# Altium schematic sheet I2C_OLED_DRV2605.SchDoc
size A; SheetNumber: 2; SheetTotal: 5
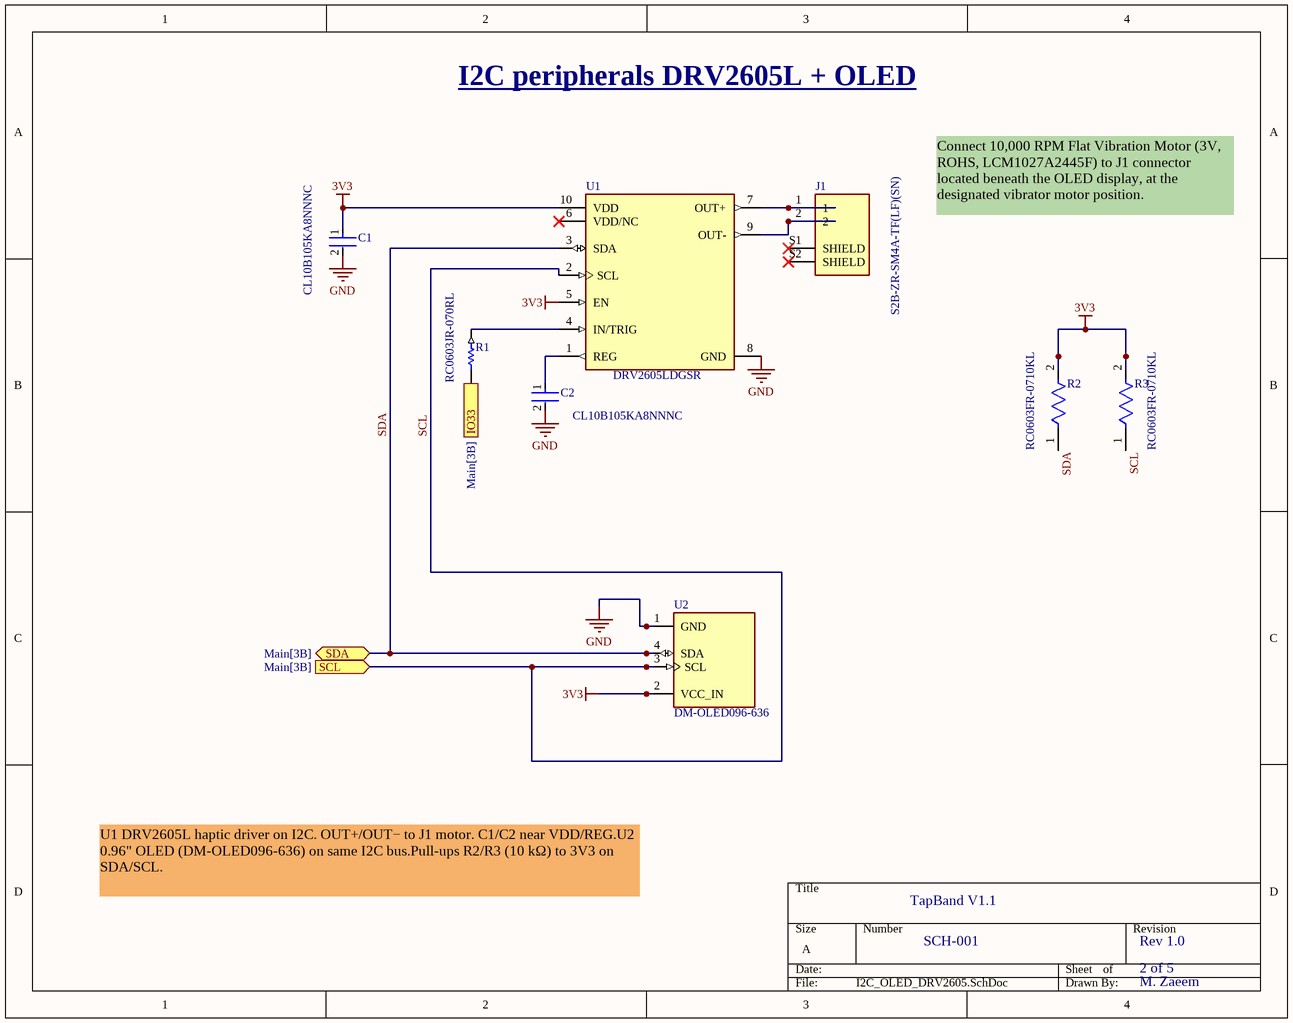
[diagram p0: I2C_OLED_DRV2605.SchDoc]

## Parts
C1  CL10B105KA8NNNC  [FP-CL10-IPC_C]
C2  CL10B105KA8NNNC  [FP-CL10-IPC_C]
J1  S2B-ZR-SM4A-TF(LF)(SN)  [JST_S2B-ZR-SM4A-TF(LF)(SN)]
R1  RC0603JR-070RL  [RESC1608X55X25ML10T15]
R2  RC0603FR-0710KL  [FP-RC0603-0_55-IPC_C]
R3  RC0603FR-0710KL  [FP-RC0603-0_55-IPC_C]
U1  DRV2605LDGSR  [FP-DGS0010A-MFG]
U2  DM-OLED096-636  [MODULE_DM-OLED096-636]

## Ports
IO33 (in, see Main[3B]), SCL (in, see Main[3B]), SDA (bidir, see Main[3B])

## Nets
3V3: C1.1 R2.2 R3.2 U1.5(EN) U1.10(VDD) U2.2(VCC_IN)
GND: C1.2 C2.2 U1.8(GND) U2.1(GND)
IO33: R1.2 ; port IO33
SCL: R3.1 U1.2(SCL) U2.3(SCL) ; port SCL
SDA: R2.1 U1.3(SDA) U2.4(SDA) ; port SDA
NetC2_1: C2.1 U1.1(REG)
NetJ1_1: J1.1 U1.7(OUT+)
NetJ1_2: J1.2 U1.9(OUT-)
NetR1_1: R1.1 U1.4(IN/TRIG)

Not connected (* = marked no-connect by the designer): J1 S1(SHIELD)* S2(SHIELD)*; U1 6(VDD/NC)*

## Notes on the sheet
- I2C peripherals DRV2605L + OLED
- Connect 10,000 RPM Flat Vibration Motor (3V, ROHS, LCM1027A2445F) to J1 connector located beneath the OLED display, at the designated vibrator motor position.
- U1 DRV2605L haptic driver on I2C. OUT+/OUT− to J1 motor. C1/C2 near VDD/REG.U2 0.96" OLED (DM‑OLED096‑636) on same I2C bus.Pull‑ups R2/R3 (10 kΩ) to 3V3 on SDA/SCL.
- TapBand V1.1
- SCH-001
- Rev 1.0
- 2 of 5
- M. Zaeem

## Library data of the parts
C1 C2 = CMP-13271-000007-2: CAP CER 1UF 25V X7R 0603; Tolerance: 10%; Width: 0.031inch; Packaging: Tape and Reel; Package Quantity: 1; Case/Package: 0603; Series: CL; Case Code (Imperial): 0603; Radiation Hardening: No; Thickness: 0.035inch; Case Code (Metric): 1608; Min Operating Temperature: -55°C; Depth: 0.8mm; RoHS Compliant: Yes; Height: 0.8mm; Capacitance: 1uF; Mount: Surface Mount; Construction: Flat; Length: 1.6mm; Max Operating Temperature: 125°C; Voltage: 25V; Dielectric: X7R; Contact Plating: Tin; Voltage Rating: 25V
J1 = S2B-ZR-SM4A-TF(LF)(SN): Connector Header Surface Mount, Right Angle 2 position 0.059 (1.50mm); MF: JST Sales; SnapEDA_Link: https://www.snapeda.com/parts/S2B-ZR-SM4A-TF%20(LF)(SN)/JST/view-part/?ref=snap; Package: None; Value: *; MP: S2B-ZR-SM4A-TF (LF)(SN); Check_prices: https://www.snapeda.com/parts/S2B-ZR-SM4A-TF%20(LF)(SN)/JST/view-part/?ref=eda
R1 = CMP-2100-03667-1: Chip Resistor, 0 Ohm, +/- 5%, 0.1 W, -55 to 155 degC, 0603 (1608 Metric), RoHS, Tape and Reel; Manufacturer: Yageo; Temperature Coefficient: 200ppm/degreesC; Voltage Rating: 50V; Power Rating: 100mW; Resistance: 0mOhm; Width: 0.8mm; Max Operating Temperature: 155degC; Tolerance: 5%; Package Reference: 0603; Height: 0.45mm; Depth: 0.8mm; Package Description: 2-Pin Surface Mount Device, Body 1.6 x 0.8 mm; Termination: SMD/SMT; Package Quantity: 5000; Case/Package: 0603; Case Code (Imperial): 0603; Radiation Hardening: No; Number of Pins: 2; Length: 1.6mm; Lead Free: LeadFree; Voltage Rating (DC): 50V; Military Standard: Not; Datasheet URL: http://www.yageo.com/NewPortal/yageodocoutput?fileName=/pdf/R-Chip/PYu-RC_Group_51_RoHS_L_5.pdf; Manufacturer URL: http://www.yageo.com/; Packaging: TapeandReel; Case Code (Metric): 1608; Min Operating Temperature: -55degC; Composition: ThickFilm; RoHSCompliant: true; Contact Plating: Tin; Datasheet Version: Rev. 5, 10/2016; REACH SVHC: NoSVHC
R2 R3 = CMP-2100-03664-2: RES 10K OHM 1% 1/10W 0603; Voltage Rating: 75V; Voltage Rating (DC): 50V; Resistance: 10kR; Power Rating: 100mW; Temperature Coefficient: 100ppm/°C; Depth: 0.8mm; Termination: SMD/SMT; Resistor Type: Thick Film; Series: RC; Construction: Rectangular; Features: Moisture Resistant; Packaging: Tape and Reel; Min Operating Temperature: -55°C; Number of Terminations: 2; Lead Pitch: 0.3mm; RoHS Compliant: Yes; Case/Package: 0603; Resistance Tolerance: 1%; Military Standard: Not; Weight: 7.1E-05oz; Number of Pins: 2; Tolerance: 1%; Length: 1.6mm; Case Code (Imperial): 0603; Lead Free: Lead Free; Width: 0.8mm; Max Power Dissipation: 100mW; Height: 0.45mm; Max Operating Temperature: 155°C; Case Code (Metric): 1608; Size Code: 0603
U1 = CMP-04915-000060-1: IC MOTOR DRIVER 2V-5.5V 10VSSOP; Logic Function: AND GATE; Quiescent Current: 500uA; Interface: I2C; RoHS Compliant: Yes; Min Operating Temperature: -40°C; Max Operating Temperature: 85°C; Packaging: Tape and Reel; Lead Free: Lead Free; Case/Package: VSSOP; Mount: Surface Mount
U2 = DM-OLED096-636: 0.96â€ 128 X 64 MONOCHROME GRAPHIC OLED DISPLAY MODULE - I2C; SnapEDA_Link: https://www.snapeda.com/parts/DM-OLED096-636/Display+Module/view-part/?ref=snap; Package: Package; Value: *; MF: Display Module; MP: DM-OLED096-636; Check_prices: https://www.snapeda.com/parts/DM-OLED096-636/Display+Module/view-part/?ref=eda